# Altium schematic sheet SoftPropeller_V1_40P14.SchDoc: TE0722
size A4; Organization: Trenz Electronic GmbH; DocumentNumber: 7; Revision: 01; SheetNumber: 7; SheetTotal: 8; Date: 07.11.2014
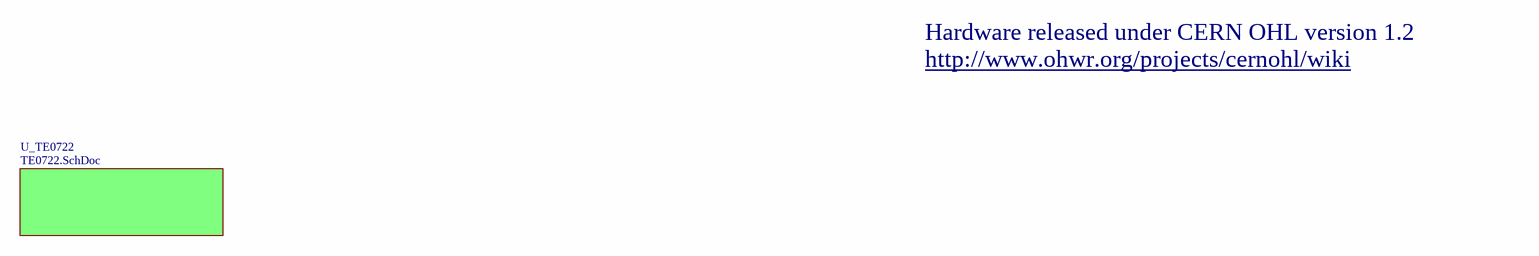
[diagram p0: SoftPropeller_V1_40P14.SchDoc]

## Sub-sheets
U_TE0722 = TE0722.SchDoc: no entries

## Notes on the sheet
- Hardware released under CERN OHL version 1.2
- http://www.ohwr.org/projects/cernohl/wiki
- Title:
- Number:
- Rev.
- Date:
- A4
- Copyright:
- Page
- of
- Filename: